# EAGLE design activity_monitor_v1.2 (EAGLE 6.4)
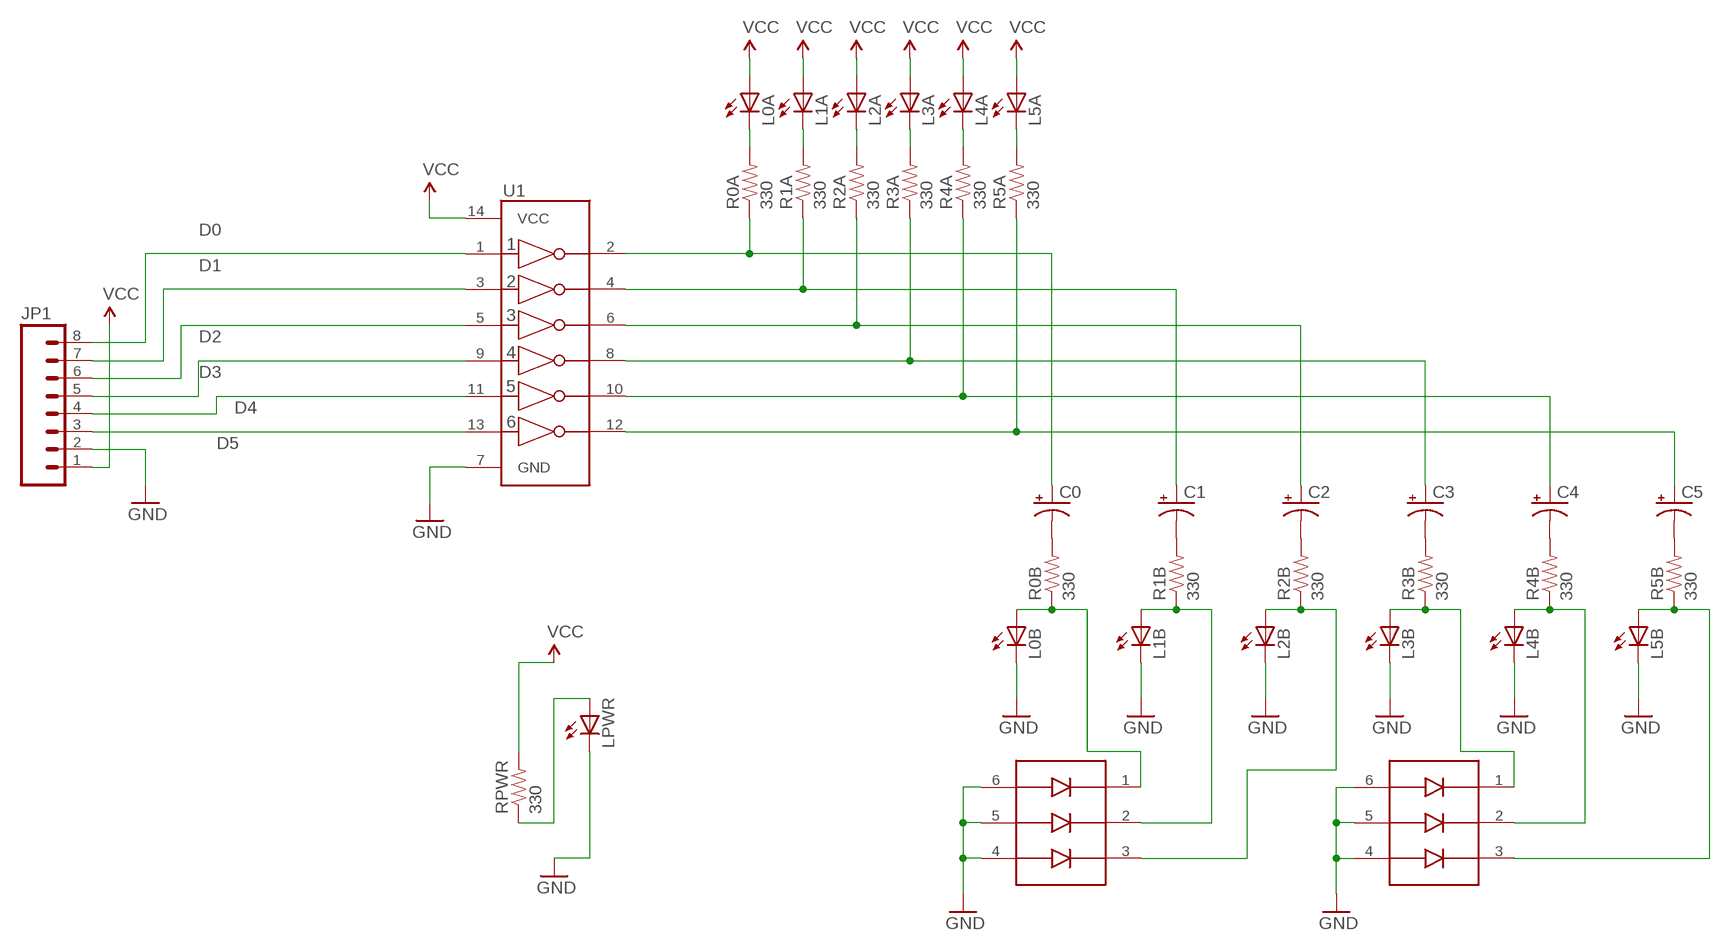
[diagram p0: schematic, sheet 1]

## Parts
C0  10UF-TANT  [EIA3216]
C1  10UF-TANT  [EIA3216]
C2  10UF-TANT  [EIA3216]
C3  10UF-TANT  [EIA3216]
C4  10UF-TANT  [EIA3216]
C5  10UF-TANT  [EIA3216]
JP1  M081X08  [1X08]
L0A  LED0603  [LED-0603]
L0B  LED0603  [LED-0603]
L1A  LED0603  [LED-0603]
L1B  LED0603  [LED-0603]
L2A  LED0603  [LED-0603]
L2B  LED0603  [LED-0603]
L3A  LED0603  [LED-0603]
L3B  LED0603  [LED-0603]
L4A  LED0603  [LED-0603]
L4B  LED0603  [LED-0603]
L5A  LED0603  [LED-0603]
L5B  LED0603  [LED-0603]
LPWR  LED0603  [LED-0603]
R0A  330  RESISTOR0603-RES  [0603-RES]
R0B  330  RESISTOR0603-RES  [0603-RES]
R1A  330  RESISTOR0603-RES  [0603-RES]
R1B  330  RESISTOR0603-RES  [0603-RES]
R2A  330  RESISTOR0603-RES  [0603-RES]
R2B  330  RESISTOR0603-RES  [0603-RES]
R3A  330  RESISTOR0603-RES  [0603-RES]
R3B  330  RESISTOR0603-RES  [0603-RES]
R4A  330  RESISTOR0603-RES  [0603-RES]
R4B  330  RESISTOR0603-RES  [0603-RES]
R5A  330  RESISTOR0603-RES  [0603-RES]
R5B  330  RESISTOR0603-RES  [0603-RES]
RPWR  330  RESISTOR0603-RES  [0603-RES]
U1  74HC04_HEX_INVERTERTSSOP14  [TSSOP14]
U$1  SD103ATW-7-F  [SOT363]
U$2  SD103ATW-7-F  [SOT363]

## Nets
D0: JP1.8 U1.1(1A)
D1: JP1.7 U1.3(2A)
D2: JP1.6 U1.5(3A)
D3: JP1.5 U1.9(4A)
D4: JP1.4 U1.11(5A)
D5: JP1.3 U1.13(6A)
GND: JP1.2 L0B.C L1B.C L2B.C L3B.C L4B.C L5B.C LPWR.C U1.7(GND) U$1.4(I3) U$1.5(I2) U$1.6(I1) U$2.4(I3) U$2.5(I2) U$2.6(I1)
N$1: C0.A(+) R0A.1 U1.2(1Y)
N$2: C1.A(+) R1A.1 U1.4(2Y)
N$3: C4.C(-) R4B.2
N$4: C5.C(-) R5B.2
N$5: L0A.C R0A.2
N$6: L1A.C R1A.2
N$7: L2A.C R2A.2
N$8: L3A.C R3A.2
N$9: C0.C(-) R0B.2
N$10: L0B.A R0B.1 U$1.1(O1)
N$11: L4A.C R4A.2
N$12: C1.C(-) R1B.2
N$13: LPWR.A RPWR.1
N$14: L5A.C R5A.2
N$15: C2.C(-) R2B.2
N$16: C2.A(+) R2A.1 U1.6(3Y)
N$17: C3.A(+) R3A.1 U1.8(4Y)
N$18: C3.C(-) R3B.2
N$19: C4.A(+) R4A.1 U1.10(5Y)
N$20: C5.A(+) R5A.1 U1.12(6Y)
R1B: L1B.A R1B.1 U$1.2(O2)
R2B: L2B.A R2B.1 U$1.3(O3)
R2B1: L4B.A R4B.1 U$2.2(O2)
R3B: L3B.A R3B.1 U$2.1(O1)
R3B1: L5B.A R5B.1 U$2.3(O3)
VCC: JP1.1 L0A.A L1A.A L2A.A L3A.A L4A.A L5A.A RPWR.2 U1.14(VCC)

## Library data of the parts
C0 C1-C5 = SparkFun-Capacitors:10UF-TANT: 10uF Tantalum SMT CAP-00811- 16V 10% (EIA-3216); PROD_ID: CAP-00811; VALUE: 10uF
JP1 = SparkFun-Connectors:M08: Header 8 Standard 8-pin 0.1" header. Use with straight break away headers (SKU : PRT-00116), right angle break away headers (PRT-00553), swiss pins (PRT-00743), machine pins (PRT-00117), and female headers (PRT-00115).
L0A L0B L1A L1B L2A L2B L3A L3B L4A L4B L5A L5B LPWR = SparkFun-LED:LED: LEDs Standard schematic elements and footprints for 5mm, 3mm, 1206, and 0603 sized LEDs. 5mm - Spark Fun Electronics SKU : COM-00529 (and others)
R0A R0B R1A R1B R2A R2B R3A R3B R4A R4B R5A R5B RPWR = SparkFun-Passives:RESISTOR: Resistor Basic schematic elements and footprints for 0603, 1206, and PTH resistors.
U1 = kmod:74HC04_HEX_INVERTER: 74HC04 Hex Inverter
U$1 U$2 = kmod:SD103ATW-7-F: Diode array: 3x

## Net classes
0 default: width 0.152 mm, clearance 0.152 mm

## Board
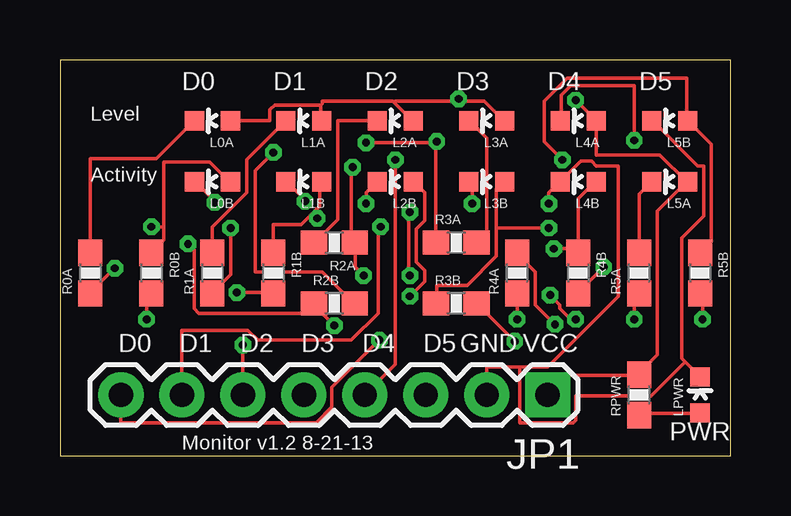
[diagram p1: board, top side]
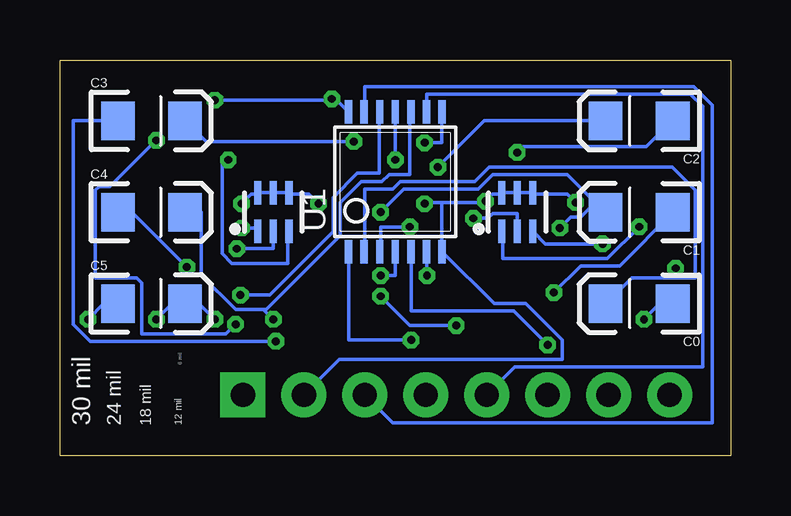
[diagram p2: board, bottom side, seen from below]

Size 27.94 x 16.51 mm. Coordinates in mm from the lower left corner, seen from the top.
Outline: 0,0 27.94,0 27.94,16.51 0,16.5 0,0
Copper layers (1*16): Top 0.0356mm / dielectric 1.5011mm / Bottom 0.0356mm
Design rules "OSHPark *": minimum track width 6mil, minimum drill 13mil, track to track 6mil, track to pad 6mil, pad to pad 6mil, via to via 6mil, smd to smd 6mil, copper to edge 15mil, drill to drill 6mil, minimum pad ring 7mil, minimum via ring 7mil, stop-mask expansion 0mil, vias tented up to drill 13mil, thermal gap 10mil

### Footprints (pad centres in the part's own frame; a part is rotated, then mirrored left to right if it is on the bottom)
EIA3216 = smd 1.4 x 1.6: A 1.4,0; C -1.4,0
1X08 = drill 1.016 pad 1.88 square: 1 0,0 | drill 1.016 pad 1.88: 2 2.54,0; 3 5.08,0; 4 7.62,0; 5 10.16,0; 6 12.7,0; 7 15.24,0; 8 17.78,0
LED-0603 = smd 0.8 x 0.8: A 0,-0.75; C 0,0.75
0603-RES = smd 1.1 x 1: 1 -0.85,0; 2 0.85,0
TSSOP14 = smd 0.305 x 0.991: 1 -1.95,-2.918; 2 -1.3,-2.918; 3 -0.65,-2.918; 4 0,-2.918; 5 0.65,-2.918; 6 1.3,-2.918; 7 1.95,-2.918; 8 1.95,2.918; 9 1.3,2.918; 10 0.65,2.918; 11 0,2.918; 12 -0.65,2.918; 13 -1.3,2.918; 14 -1.95,2.918
SOT363 = smd 0.3 x 0.99: 1 -0.65,-0.8; 2 0,-0.8; 3 0.65,-0.8; 4 0.65,0.81; 5 0,0.81; 6 -0.65,0.81

### Placement (x,y rotation side)
C0  3.81,6.35 180 bottom
C1  3.81,10.16 180 bottom
C2  3.81,13.97 180 bottom
C3  24.13,13.97 0 bottom
C4  24.13,10.16 0 bottom
C5  24.13,6.35 0 bottom
JP1  20.32,2.54 180 top
L0A  6.35,13.97 90 top
L0B  6.35,11.43 90 top
L1A  10.16,13.97 90 top
L1B  10.16,11.43 90 top
L2A  13.97,13.97 90 top
L2B  13.97,11.43 90 top
L3A  17.78,13.97 90 top
L3B  17.78,11.43 90 top
L4A  21.59,13.97 90 top
L4B  21.59,11.43 90 top
L5A  25.4,11.43 90 top
L5B  25.4,13.97 90 top
LPWR  26.67,2.54 0 top
R0A  1.27,7.62 90 top
R0B  3.81,7.62 270 top
R1A  6.35,7.62 90 top
R1B  8.89,7.62 270 top
R2A  11.43,8.89 180 top
R2B  11.43,6.35 0 top
R3A  16.51,8.89 0 top
R3B  16.51,6.35 0 top
R4A  19.05,7.62 90 top
R4B  21.59,7.62 270 top
R5A  24.13,7.62 90 top
R5B  26.67,7.62 270 top
RPWR  24.13,2.54 90 top
U1  13.97,11.43 0 bottom
U$1  8.89,10.16 0 bottom
U$2  19.05,10.16 0 bottom

### Tracks (layer width: path | path; a pad name or v marks a point on that pad's centre or on a via)
D0  (via drill 0.33)
  Top 0.152: v13.31,4.83 11.33,2.85 11.33,2.03 10.67,1.37 2.54,1.37 JP1.8
  Bottom 0.152: v13.31,4.83 15.9,4.83 15.9,8.48 U1.1
D1  (via drill 0.33)
  Top 0.152: v13.36,9.55 13.26,9.45 13.26,5.94 12.14,4.83 8.23,4.83 7.82,5.23 5.08,5.23 JP1.7
  Bottom 0.152: v13.36,9.55 14.58,9.55 14.58,8.53 U1.3
D2  (via drill 0.33)
  Top 0.152: JP1.6 v7.62,4.62
  Bottom 0.152: v7.62,4.62 9.04,6.04 13.31,6.04 13.31,8.48 U1.5
D3
  Bottom 0.152: JP1.5 8.99,3.71 1.17,3.71 1.17,14.58 1.68,15.09 12.65,15.09 12.65,14.38 U1.9
D4  (via drill 0.33)
  Top 0.152: v13.97,12.34 13.97,3.81 JP1.4
  Bottom 0.152: v13.97,12.34 U1.11
D5
  Bottom 0.152: JP1.3 14.07,1.37 0.76,1.37 0.76,14.63 1.52,15.39 15.24,15.39 15.24,14.38 U1.13
GND  (via drill 0.33)
  Top 0.152: 26.06,3.91 26.67,3.3 LPWR.C | 26.06,3.91 25.91,4.06 25.91,9.09 26.82,10.01 26.82,12.09 26.57,12.09 24.69,13.97 L5B.C | v6.45,10.57 6.45,10.62 5.64,11.43 L0B.C | v10.21,10.62 10.21,10.67 9.45,11.43 L1B.C | v12.75,10.52 12.75,10.97 13.21,11.43 L2B.C | v20.37,10.52 20.37,10.97 20.83,11.43 L4B.C 20.88,11.48 21.69,12.29 22.15,12.29 22.35,12.09 23.27,12.09 23.27,6.66 20.32,3.71 19.15,3.71 | v17.17,10.52 17.17,11.33 17.07,11.43 L3B.C | 19.15,3.71 17.78,3.71 JP1.2 | 26.06,3.91 24.64,2.49 21.49,2.49 21.49,1.47 21.39,1.37 19.15,1.37 19.15,3.71
  Bottom 0.152: v6.45,10.57 6.81,10.92 8.23,10.92 U$1.4 8.28,10.97 U$1.5 8.94,10.97 9.5,10.97 U$1.6 9.55,10.92 9.91,10.92 v10.21,10.62 10.26,10.57 12.04,10.57 | v12.75,10.52 12.7,10.57 12.04,10.57 | 12.04,10.57 12.04,8.53 U1.7 11.99,8.48 9.86,6.35 8.53,6.35 7.01,4.83 7.01,4.01 16.31,4.01 JP1.2 | v20.37,10.52 19.96,10.92 19.71,10.92 U$2.6 19.66,10.97 19.1,10.97 U$2.5 18.44,10.97 U$2.4 18.39,10.92 17.58,10.92 v17.17,10.52
N$1  (via drill 0.33)
  Top 0.152: v2.29,7.82 1.27,6.81 R0A.1
  Bottom 0.152: 2.29,7.42 4.12,7.42 5.18,6.35 C0.A | 2.29,7.42 1.47,7.42 1.47,11.07 2.44,12.04 10.06,12.04 10.67,11.43 13.77,11.43 14.07,11.12 15.24,11.12 15.24,8.53 U1.2 | 2.29,7.42 v2.29,7.82
N$2  (via drill 0.33)
  Top 0.152: v14.58,7.52 14.53,7.57 14.53,10.11 v14.58,10.16 | v7.11,9.5 7.11,7.57 6.35,6.81 R1A.1
  Bottom 0.152: U1.4 13.97,7.52 v14.58,7.52 | v14.58,10.16 13.61,11.12 10.52,11.12 9.91,11.73 6.81,11.73 5.23,10.16 C1.A 5.69,10.52 6.25,9.96 6.66,9.96 v7.11,9.5
N$3  (via drill 0.33)
  Top 0.152: v22.66,7.87 21.59,6.81 R4B.2
  Bottom 0.152: v22.66,7.87 24.94,10.16 C4.C
N$4  (via drill 0.33)
  Top 0.152: v26.77,5.69 26.77,6.66 26.67,6.76 R5B.2
  Bottom 0.152: v26.77,5.69 26.11,6.35 C5.C
N$5
  Top 0.152: R0A.2 1.27,12.39 4.01,12.39 5.59,13.97 L0A.C
N$6
  Top 0.152: R1A.2 6.35,9.55 7.77,10.97 7.77,12.34 9.4,13.97 L1A.C
N$7
  Top 0.152: L2A.C 11.58,13.97 11.58,9.86 10.62,8.89 R2A.2
N$8
  Top 0.152: L3A.C 17.07,13.97 17.78,13.26 17.78,9.3 17.37,8.89 R3A.2
N$9  (via drill 0.33)
  Top 0.152: v3.61,5.69 3.61,6.55 3.81,6.76 R0B.2
  Bottom 0.152: v3.61,5.69 2.95,6.35 C0.C
N$10  (via drill 0.33)
  Top 0.152: 4.32,9.55 4.32,8.99 3.81,8.48 R0B.1 | 4.32,9.55 4.32,12.24 6.25,12.24 7.06,11.43 L0B.A | 4.32,9.55 v3.81,9.55
  Bottom 0.152: v3.81,9.55 5.13,8.23 9.5,8.23 9.5,9.35 U$1.1
N$11  (via drill 0.33)
  Top 0.152: v23.93,13.16 23.93,15.44 21.29,15.44 20.88,15.04 20.88,13.97 L4A.C | v20.62,5.49 19.81,6.3 19.81,7.67 19.05,8.43 R4A.2
  Bottom 0.152: v23.93,13.16 25.86,11.23 26.31,11.23 26.47,11.07 26.47,7.42 24.74,7.42 24.54,7.21 24.54,5.08 21.03,5.08 v20.62,5.49
N$12  (via drill 0.33)
  Top 0.152: v7.37,6.81 8.89,6.81 R1B.2
  Bottom 0.152: v7.37,6.81 6.25,7.92 4.62,7.92 2.39,10.16 C1.C
N$13
  Top 0.152: RPWR.1 24.13,1.78 26.67,1.78 LPWR.A
N$14
  Top 0.152: R5A.2 24.13,10.92 24.64,11.43 L5A.C
N$15  (via drill 0.33)
  Top 0.152: v8.89,12.65 8.13,11.89 8.13,7.67 10.92,7.67 12.24,6.35 R2B.2
  Bottom 0.152: v8.89,12.65 8.64,12.9 3.5,12.9 2.44,13.97 C2.C
N$16  (via drill 0.33)
  Top 0.152: v12.65,7.52 12.29,7.87 12.29,8.89 R2A.1 12.24,8.94 12.14,9.04 12.14,11.99 v12.19,12.04
  Bottom 0.152: v12.65,7.52 12.65,8.48 U1.6 | v12.19,12.04 10.26,13.97 C2.A
N$17  (via drill 0.33)
  Top 0.152: 15.65,13.06 v12.75,13.06 | 15.65,13.06 15.65,8.89 R3A.1 | v15.7,13.11 15.65,13.06
  Bottom 0.152: v12.75,13.06 12.04,13.06 12.04,14.33 U1.8 | v15.7,13.11 21.84,13.11 22.71,13.97 C3.A
N$18  (via drill 0.33)
  Top 0.152: v18.95,4.78 17.37,6.35 R3B.2
  Bottom 0.152: v18.95,4.78 26.67,4.78 27.38,5.49 27.38,13.97 C3.C
N$19  (via drill 0.33)
  Top 0.152: v19.05,5.69 R4A.1
  Bottom 0.152: 19.36,6.1 16.26,9.2 16.26,10.57 15.39,11.43 14.53,11.43 14.22,11.73 13.36,11.73 13.36,14.33 U1.10 | 19.36,6.1 20.62,6.1 22.05,7.52 22.05,10.16 C4.A | v19.05,5.69 19.41,6.04 19.36,6.1
N$20  (via drill 0.33)
  Top 0.152: v20.42,6.71 20.83,6.3 20.83,6.15 21.29,5.69 v21.49,5.69 | v23.93,5.69 23.93,6.55 24.13,6.76 R5A.1
  Bottom 0.152: v20.42,6.71 19.2,6.71 16.56,9.35 16.56,10.77 15.54,11.79 14.63,11.79 14.63,14.33 U1.12 | v21.49,5.69 22.15,6.35 C5.A 22.76,6.3 23.32,6.3 v23.93,5.69
R1B  (via drill 0.33)
  Top 0.152: 10.52,10.11 10.06,9.65 8.89,9.65 R1B.1 | 10.52,10.11 10.82,10.41 10.82,11.38 10.87,11.43 L1B.A | 10.52,10.11 v10.72,9.91
  Bottom 0.152: U$1.2 8.89,10.11 9.91,10.11 10.11,9.91 v10.72,9.91
R2B  (via drill 0.33)
  Top 0.152: v14.58,6.66 15.19,7.26 15.19,7.72 14.83,8.08 14.83,9.45 15.19,9.8 15.19,10.97 14.73,11.43 L2B.A | v11.43,5.44 10.62,6.25 10.62,6.35 R2B.1 10.57,6.2 10.57,5.94 5.79,5.94 5.59,6.15 5.59,8.59 v5.33,8.84
  Bottom 0.152: v14.58,6.66 13.36,5.44 v11.43,5.44 | v5.33,8.84 7.72,8.84 8.23,9.35 U$1.3
R2B1  (via drill 0.33)
  Top 0.152: L4B.A 22.3,11.43 21.59,10.72 R4B.1 21.54,8.64 v20.57,8.64
  Bottom 0.152: U$2.2 19.05,8.64 v20.57,8.64
R3B  (via drill 0.33)
  Top 0.152: 18.19,9.5 18.19,8.33 16.97,7.11 15.7,7.11 15.7,6.35 R3B.1 | 18.19,9.5 18.19,11.12 18.49,11.43 L3B.A | 18.19,9.5 v20.37,9.5
  Bottom 0.152: v20.37,9.5 19.81,9.5 19.71,9.4 U$2.1
R3B1  (via drill 0.33)
  Top 0.152: R5B.1 26.67,8.48 27.13,8.94 27.13,13.01 26.16,13.97 L5B.A 26.11,14.02 26.11,15.75 21.13,15.75 20.17,14.78 20.17,13.11 v20.93,12.34
  Bottom 0.152: v20.93,12.34 21.18,12.34 21.18,8.43 20.78,8.03 18.44,8.03 18.44,9.35 U$2.3
VCC  (via drill 0.33)
  Top 0.152: L0A.A 8.74,13.97 8.74,14.43 8.94,14.63 10.87,14.63 | 10.87,14.63 10.87,13.97 L1A.A | 13.92,14.73 13.87,14.78 10.92,14.78 10.92,14.68 10.87,14.63 | 13.92,14.73 14.68,13.97 L2A.A | 16.61,14.78 13.97,14.78 13.92,14.73 | 16.61,14.78 17.68,14.78 18.49,13.97 L3A.A | v16.61,14.88 16.61,14.78 | JP1.1 20.32,3.35 24.13,3.35 RPWR.2 24.13,3.45 24.89,4.22 24.89,10.21 26.06,11.38 L5A.A 26.11,11.43 24.99,12.55 22.35,12.55 22.35,13.97 L4A.A 22.3,14.02 v21.49,14.83
  Bottom 0.152: U1.14 15.95,14.38 16.46,14.88 v16.61,14.88 16.66,14.83 v21.49,14.83

### Text on the board
tPlace: D0 | D1 | D2 | D3 | D4 | D5 | Level | Activity | D0 | D1 | D2 | D3 | D4 | D5 | GND | VCC | PWR | Monitor v1.2 8-21-13
bPlace: 6 mil | 12 mil | 18 mil | 24 mil | 30 mil